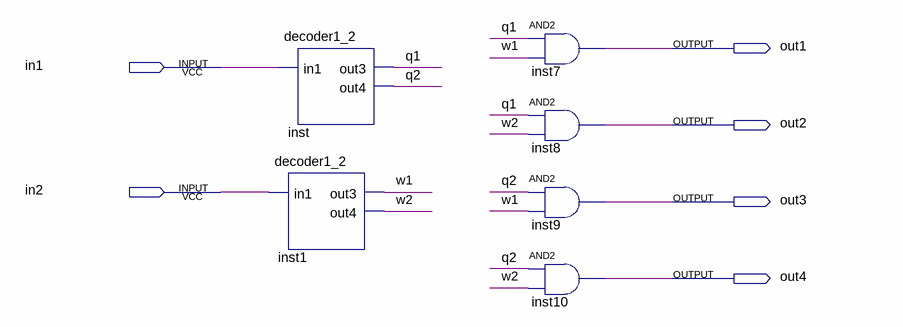
[diagram p0: schematic sheet]
// Quartus schematic decoder2_4.bdf as structural Verilog: 6 symbols, 6 pins
module decoder2_4 (
  input  in1,
  input  in2,
  output out1,
  output out2,
  output out3,
  output out4
);

  wire q1, q2, w1, w2;

  decoder1_2 inst (.in1(in1), .out3(q1), .out4(q2));
  decoder1_2 inst1 (.in1(in2), .out3(w1), .out4(w2));
  and inst7 (out1, q1, w1);
  and inst8 (out2, q1, w2);
  and inst9 (out3, q2, w1);
  and inst10 (out4, q2, w2);
endmodule
